# Altium schematic sheet схема платы фотодетектора.SchDoc
size A3
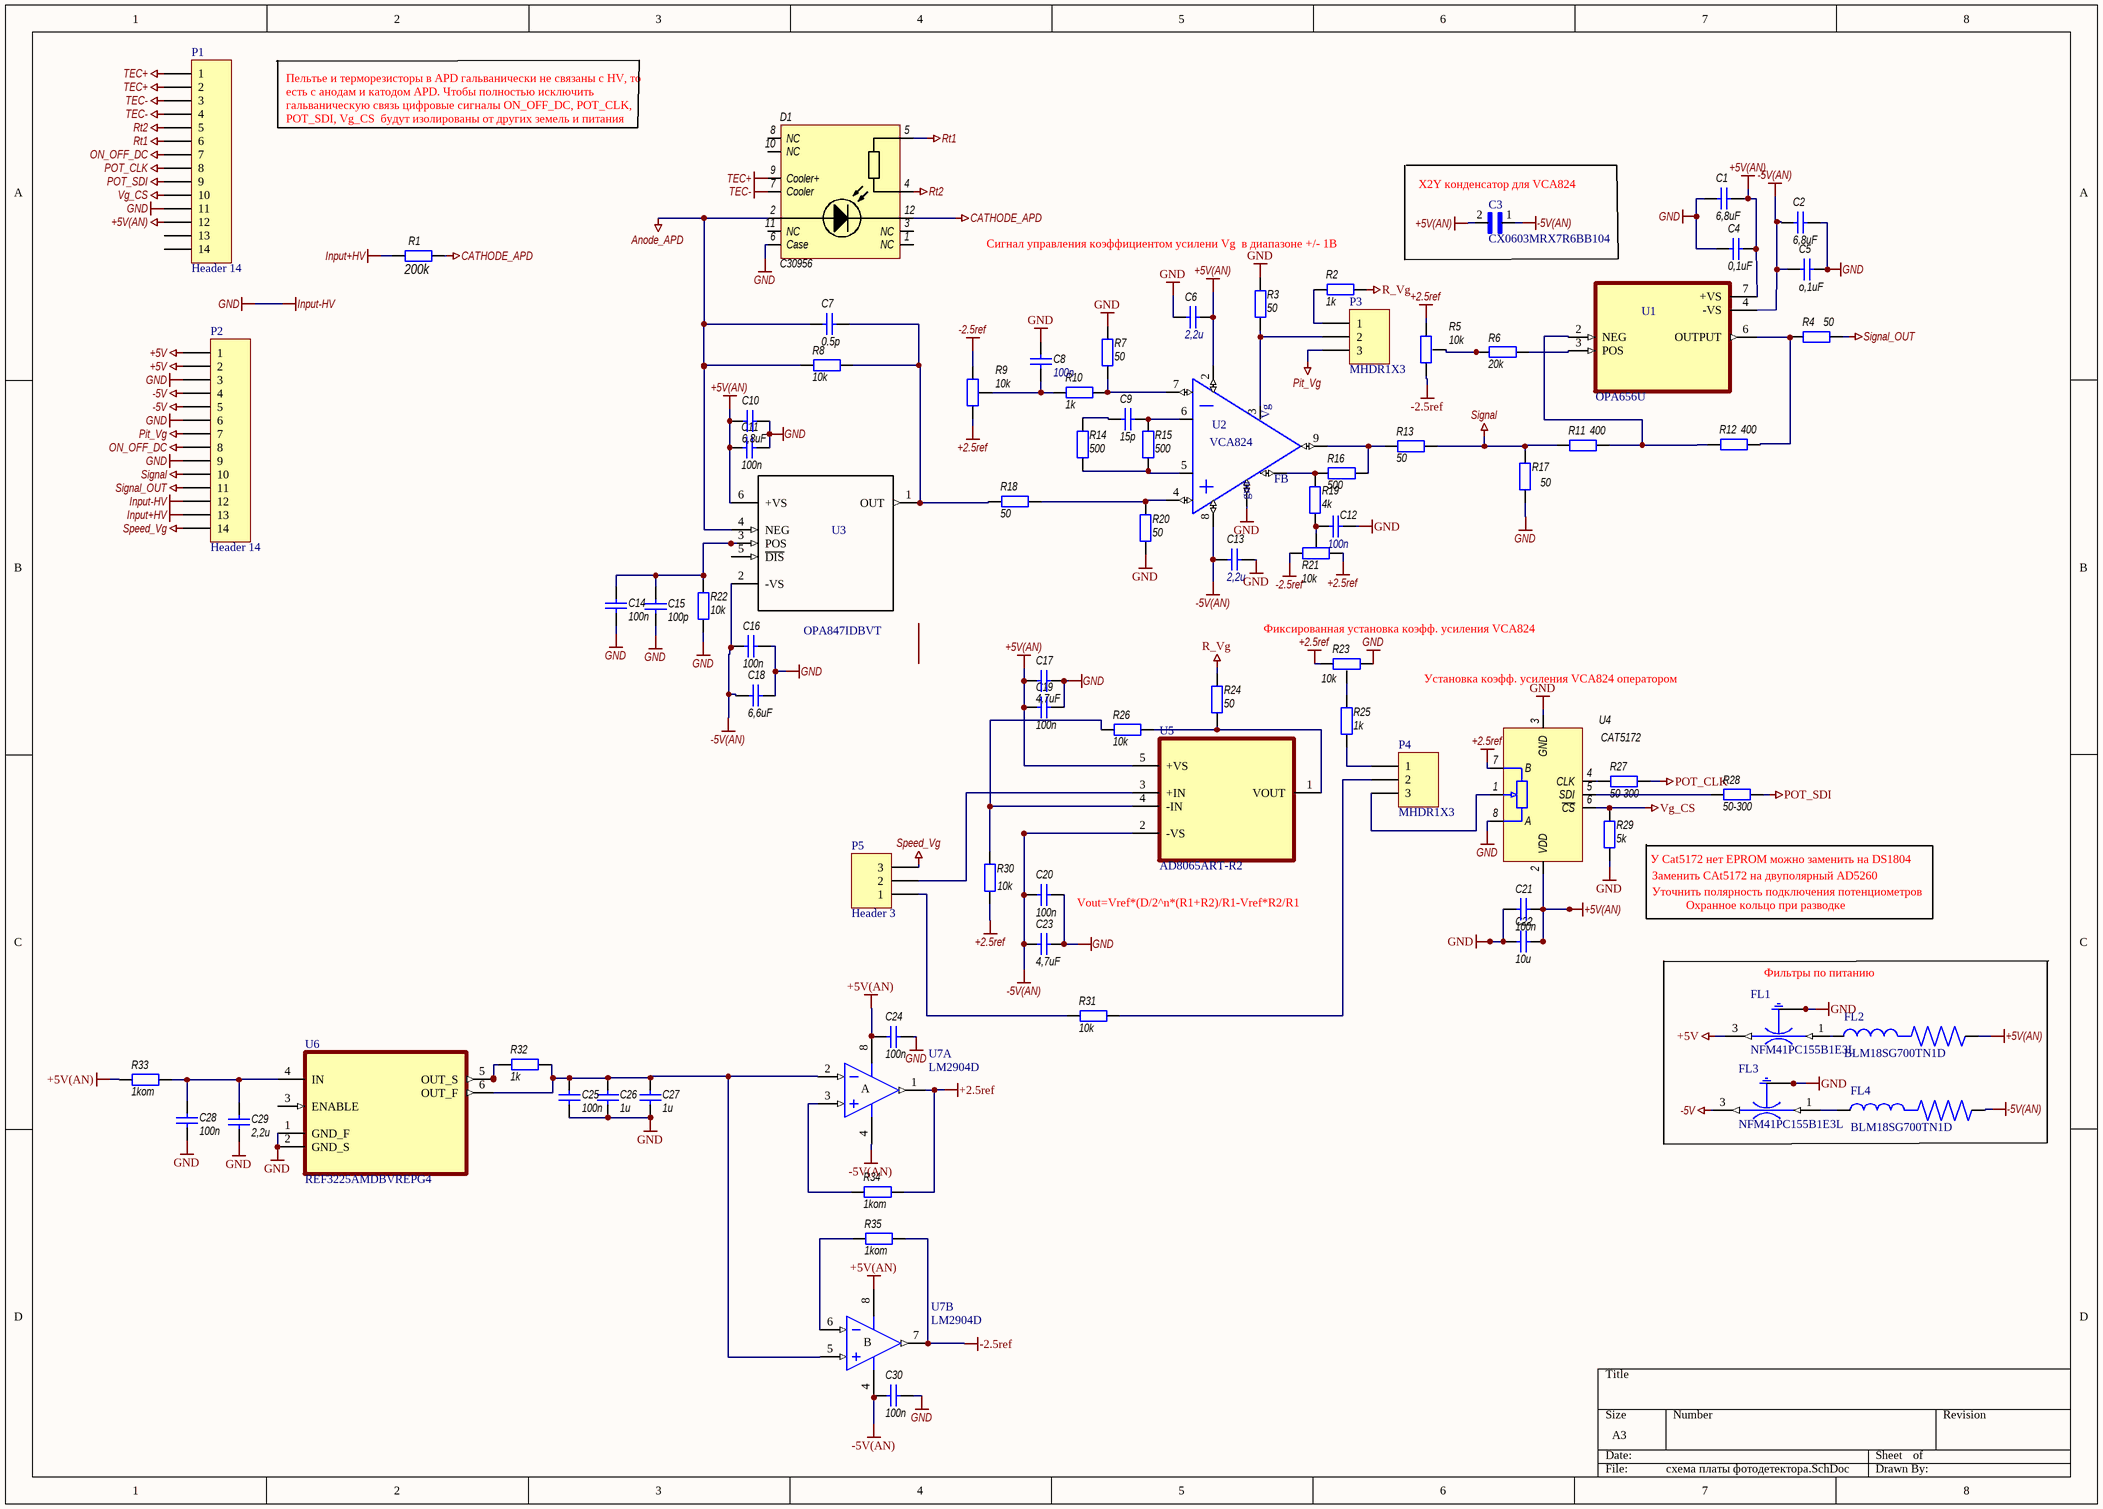
[diagram p0: схема платы фотодетектора.SchDoc]

## Parts
C1  6,8uF  [0603]
C2  6,8uF  [0603]
C3  CX0603MRX7R6BB104  [CAPC1608X90]
C4  0,1uF  [0603]
C5  o,1uF  [0603]
C6  2,2u  [0603]
C7  0.5p  [0603]
C8  100n  [0603]
C9  15p  [0603]
C10  6,8uF  [0603]
C11  100n  [0603]
C12  100n  [0603]
C13  2,2u  [0603]
C14  100n  [0603]
C15  100p  [0603]
C16  100n  [0603]
C17  4,7uF  [0603]
C18  6,6uF  [0603]
C19  100n  [0603]
C20  100n  [0603]
C21  100n  [0603]
C22  10u  [0603]
C23  4,7uF  [0603]
C24  100n  [0603]
C25  100n  [0603]
C26  1u  [0603]
C27  1u  [0603]
C28  100n  [0603]
C29  2,2u  [0603]
C30  100n  [0603]
D1  C30956  [C30659]
FL1  NFM41PC155B1E3L  [FIL_NFM41PC155B1E3L]
FL2  BLM18SG700TN1D  [BEADC2012X105N]
FL3  NFM41PC155B1E3L  [FIL_NFM41PC155B1E3L]
FL4  BLM18SG700TN1D  [BEADC2012X105N]
P1  Header 14  [HDR1X14]
P2  Header 14  [HDR1X14]
P3  MHDR1X3  [HDR1X3]
P4  MHDR1X3  [HDR1X3]
P5  Header 3  [HDR1X3]
R1  value 200k  [0603]  (hidden comment: CHV1206)
R2  1k  [0603]
R3  50  [0603]
R4  50  [0603]
R5  10k  [respotBourns]
R6  20k  [0603]
R7  50  [0603]
R8  10k  [0603]
R9  10k  [respotBourns]
R10  1k  [0603]
R11  400  [0603]
R12  400  [0603]
R13  50  [0603]
R14  500  [0603]
R15  500  [0603]
R16  500  [0603]
R17  50  [0603]
R18  50  [0603]
R19  4k  [0603]
R20  50  [0603]
R21  10k  [respotBourns]
R22  10k  [0603]
R23  10k  [respotBourns]
R24  50  [0603]
R25  1k  [0603]
R26  10k  [0603]
R27  50-300  [0603]
R28  50-300  [0603]
R29  5k  [0603]
R30  10k  [0603]
R31  10k  [0603]
R32  1k  [0603]
R33  1kom  [0603]
R34  1kom  [0603]
R35  1kom  [0603]
U1  OPA656U  [SOIC127P599X175-8N]
U2  VCA824  [MSOP10]
U3  OPA847IDBVT  [*SOT95P280X145-6N]
U4  CAT5172  [SOT238]
U5  AD8065ART-R2  [SOT95P290X145-5N]
U6  REF3225AMDBVREPG4  [SOT95P280X145-6N]
U7  LM2904D  [SO8_L]  (parts A,B of 2)

## Blocks framed on the sheet
X2Y конденсатор для VCA824: C3

## Nets
+2.5ref: R5.1 R9.3 R21.3 R23.3 R30.1 R34.1 U4.7(B) U7.1(OUT)
+5V: FL1.3(OUT) P2.1 P2.2
+5V(AN): C1.1 C3.2 C4.1 C6.1 C10.1 C11.2 C17.2 C19.2 C21.2 C22.2 C24.2 FL2.2 P1.12 R33.2 U1.7(+VS) U2.2(V+) U3.6(+VS) U4.2(VDD) U5.5(+VS) U7.8(V+)
-2.5ref: R5.3 R9.1 R21.1 R35.1 U7.7(OUT)
-5V: FL3.3(OUT) P2.4 P2.5
-5V(AN): C2.2 C3.1 C5.2 C13.2 C16.2 C18.1 C20.2 C23.2 C30.2 FL4.2 U1.4(-VS) U2.8(V-) U3.2(-VS) U5.2(-VS) U7.4(V-)
Anode_APD: C7.2 D1.2 R8.1 U3.4(NEG)
CATHODE_APD: D1.12 R1.2
GND: C1.2 C2.1 C4.2 C5.1 C6.2 C8.2 C10.2 C11.1 C12.1 C13.1 C14.1 C15.2 C16.1 C17.1 C18.2 C19.1 C20.1 C21.1 C22.1 C23.1 C24.1 C25.1 C26.1 C27.1 C28.1 C29.1 C30.1 D1.6(Case) FL1.2(GND) FL1.2_1(GND) FL1.2_3(GND) FL1.2_4(GND) FL3.2(GND) FL3.2_1(GND) FL3.2_3(GND) FL3.2_4(GND) P1.11 P2.3 P2.6 P2.9 P2.12 R3.2 R7.2 R17.1 R20.1 R22.2 R23.1 R29.1 U2.10(GND) U4.3(GND) U4.8(A) U6.1(GND_F) U6.2(GND_S)  [also labelled Input-HV]
Input+HV: P2.13 R1.1
ON_OFF_DC: P1.7 P2.8
Pit_Vg: P2.7 P3.3
POT_CLK: P1.8 R27.2
POT_SDI: P1.9 R28.2
R_Vg: R2.2 R24.2
Rt1: D1.5 P1.6
Rt2: D1.4 P1.5
Signal: P2.10 R11.1 R13.2 R17.2
Signal_OUT: P2.11 R4.2
Speed_Vg: P2.14 P5.3
TEC+: D1.9(Cooler+) P1.1 P1.2
TEC-: D1.7(Cooler) P1.3 P1.4
Vg_CS: P1.10 R29.2 U4.6(~{CS})
NetC7_1: C7.1 R8.2 R18.1 U3.1(OUT)
NetC8_1: C8.1 R9.2 R10.1
NetC9_1: C9.1 R15.2 U2.6(RG-)
NetC9_2: C9.2 R14.2
NetC12_2: C12.2 R19.1 R21.2
NetC14_2: C14.2 C15.1 R22.1 U3.3(POS)
NetC25_2: C25.2 C26.2 C27.2 R32.2 U6.6(OUT_F) U7.2(IN-) U7.5(IN+)
NetC28_2: C28.2 C29.2 R33.1 U6.4(IN)
NetFL1_1: FL1.1(IN) FL2.1
NetFL3_1: FL3.1(IN) FL4.1
NetP3_1: P3.1 R2.1
NetP3_2: P3.2 R3.1 U2.3(VG)
NetP4_1: P4.1 R25.1
NetP4_2: P4.2 R31.2
NetP4_3: P4.3 U4.1
NetP5_1: P5.1 R31.1
NetP5_2: P5.2 U5.3(+IN)
NetR4_1: R4.1 R12.2 U1.6(OUTPUT)
NetR5_2: R5.2 R6.1
NetR6_2: R6.2 U1.3(POS)
NetR7_1: R7.1 R10.2 U2.7(IN-)
NetR11_2: R11.2 R12.1 U1.2(NEG)
NetR13_1: R13.1 R16.2 U2.9(OUT)
NetR14_1: R14.1 R15.1 U2.5(RG+)
NetR16_1: R16.1 R19.2 U2.1(FB)
NetR18_2: R18.2 R20.2 U2.4(IN+)
NetR23_2: R23.2 R25.2
NetR24_1: R24.1 R26.2 U5.1(VOUT)
NetR26_1: R26.1 R30.2 U5.4(-IN)
NetR27_1: R27.1 U4.4(CLK)
NetR28_1: R28.1 U4.5(SDI)
NetR32_1: R32.1 U6.5(OUT_S)
NetR34_2: R34.2 U7.3(IN+)
NetR35_2: R35.2 U7.6(IN-)

Not connected (* = marked no-connect by the designer): D1 1(NC) 3(NC) 8(NC) 10(NC) 11(NC); P1 13 14; U3 5(~{DIS}); U6 3(ENABLE)

## Notes on the sheet
- Пельтье и терморезисторы в APD гальванически не связаны с HV, то есть с анодам и катодом APD. Чтобы полностью исключить гальваническую связь цифровые сигналы ON_OFF_DC, POT_CLK, POT_SDI, Vg_CS  будут изолированы от других земель и питания
- Сигнал управления коэффициентом усилени Vg  в диапазоне +/- 1В
- (near R23) Фиксированная установка коэфф. усиления VCA824
- Установка коэфф. усиления VCA824 оператором
- Vout=Vref*(D/2^n*(R1+R2)/R1-Vref*R2/R1
- У Cat5172 нет EPROM можно заменить на DS1804
- Уточнить полярность подключения потенциометров
- Заменить CAt5172 на двуполярный AD5260
- Охранное кольцо при разводке
- (near FL1) Фильтры по питанию
- (in symbol LM2904D, part A) A
- (in symbol LM2904D, part B) B
- (in symbol VCA824) Vg; gnd

## Library data of the parts
C1 C2 C4-C6 C9 C10 C13 C17 C18 C22 C23 C26 C27 C29 = _capacitor: Model: 0603 100n; Value: 100n
C3 = CX0603MRX7R6BB104: 0.1ÂµF Â±20% 10V Ceramic Capacitor X7R 0603 (1608 Metric); MF: Yageo; Package: 0603 Yageo; Value: *; Price: None; MP: CX0603MRX7R6BB104; SnapEDA_Link: https://www.snapeda.com/parts/CX0603MRX7R6BB104/Yageo/view-part/493624/?ref=snap; Availability: Unavailable
C7 = _capacitor: Model: 0603 0.5p; Value: 0.5p
C8 C11 C12 C14 C16 C19-C21 C24 C25 C28 C30 = _capacitor: Model: 0603 100n; Value: 100n
C15 = _capacitor: Model: 0603 100p; Value: 100p
D1 = C30956: ADP_Diod; Model: C30956
FL1 FL3 = NFM41PC155B1E3L: ÐšÐ¾Ð½Ð´ÐµÐ½ÑÐ°Ñ‚Ð¾Ñ€ SMD Ñ ÐµÐ¼ÐºÐ¾ÑÑ‚ÑŒÑŽ: 1.5 ÐœÐšÐ¤ Ð¢Ð¾Ð». 20%. ÐÐ¾Ð¼Ð¸Ð½Ð°Ð»ÑŒÐ½Ð¾Ðµ Ð½Ð°Ð¿Ñ€ÑÐ¶ÐµÐ½Ð¸Ðµ: 25Vdc; MF: Murata; Price: None; Value: *; SnapEDA_Link: https://www.snapeda.com/parts/NFM41PC155B1E3L/Murata/view-part/4383493/?ref=snap; Package: NONSTANDARD; Availability: Unavailable; DigiKey-Purchase-URL: https://snapeda.com/shop?store=DigiKey&id=4383493; MP: NFM41PC155B1E3L
FL2 FL4 = BLM21SP111SN1D: 110 Ð¾Ð¼ @ 100 ÐœÐ“Ñ† 1 Ð»Ð¸Ð½Ð¸Ñ ÑÐ»ÐµÐºÑ‚Ñ€Ð¾Ð¿ÐµÑ€ÐµÐ´Ð°Ñ‡ Ñ„ÐµÑ€Ñ€Ð¸Ñ‚Ð¾Ð²Ñ‹Ð¹ ÑˆÐ°Ñ€Ð¸Ðº 0805 (2012 ÐœÐµÑ‚Ñ€Ð¸ÐºÐ°) 5A; MF: Murata; Price: None; Value: *; SnapEDA_Link: https://www.snapeda.com/parts/BLM21SP111SN1D/Murata/view-part/4302973/?ref=snap; Package: 2012 Murata; Availability: Unavailable; MP: BLM21SP111SN1D
P1 P2 = Header 14: Header, 14-Pin; LatestRevisionDate: 17-Jul-2002; LatestRevisionNote: Re-released for DXP Platform.; Publisher: Altium Limited
P3 P4 = MHDR1X3: Header, 3-Pin; LatestRevisionDate: 17-Jul-2002; LatestRevisionNote: Re-released for DXP Platform.; Publisher: Altium Limited
P5 = Header 3: Header, 3-Pin; LatestRevisionDate: 17-Jul-2002; LatestRevisionNote: Re-released for DXP Platform.; Publisher: Altium Limited
R1 = _resistor: Model: 1206 10mOm
R2 R3 R7 R10 R13-R16 R18-R20 R24-R32 = _resistor: Model: 0603 51; Value: 51
R4 R11 R12 = _resistor: Model: 0603 10; Value: 10
R5 R9 R21 = _resistor_pot: 3224J-1-103; Model: 3266P-1-102LF; Value: 1k
R6 = _resistor: Model: 0603 10k; Value: 10k
R8 R22 = _resistor: Model: 0603 10k; Value: 10k
R17 R33-R35 = _resistor: Model: 0603 100; Value: 100
R23 = _resistor_pot: 3224j-1-103; Model: 3266P-1-102LF; Value: 1k
U1 = OPA656U: Wideband, Unity Gain Stable FET-Input Operational Amplifier; MF: Texas Instruments; Package: SOIC-8 Texas Instruments; Value: *; Price: None; Availability: Unavailable; MP: OPA656U; Texas_Instruments-Purchase-URL: https://snapeda.com/shop?store=Texas+Instruments&id=454826; Mouser-Purchase-URL: https://snapeda.com/shop?store=Mouser&id=454826; DigiKey-Purchase-URL: https://snapeda.com/shop?store=DigiKey&id=454826; SnapEDA_Link: https://www.snapeda.com/parts/OPA656U/Texas%20Instruments/view-part/454826/?ref=snap
U2 = VCA824: MF: Texas Instruments; Price: None; Value: *; SnapEDA_Link: https://www.snapeda.com/parts/VCA824/Texas%20Instruments/view-part/570912/?ref=snap; Package: None; Availability: Unavailable; MP: VCA824
U4 = CAT5172: Digital potentiometr 256-position SPI; Model: CAT5172; ComponentLink1Description: Datasheet; ComponentLink1URL: X:\Projects\__MY_AD_LIB\Datasheets\CAT5172.pdf
U5 = AD8065ART-R2: Ð£ÑÐ¸Ð»Ð¸Ñ‚ÐµÐ»ÑŒ Ð¾Ð±Ñ€Ð°Ñ‚Ð½Ð¾Ð¹ ÑÐ²ÑÐ·Ð¸ Ð¿Ð¾ Ð½Ð°Ð¿Ñ€ÑÐ¶ÐµÐ½Ð¸ÑŽ 1 Ñ†ÐµÐ¿ÑŒ Ñ€ÐµÐ»ÑŒÑ-Ñ€ÐµÐ»ÑŒÑ SOT-23-5; MF: Analog Devices; MP: AD8065ART-R2; Package: SOT-23-5 Analog Devices; SnapEDA_Link: https://www.snapeda.com/parts/AD8065ART-R2/Analog%20Devices%20Inc./view-part/888431/?ref=snap; Price: None; Availability: Unavailable; Value: *; DigiKey-Purchase-URL: https://snapeda.com/shop?store=DigiKey&id=888431
U6 = REF3225AMDBVREPG4: Ð£Ð²ÐµÐ»Ð¸Ñ‡ÐµÐ½Ð½Ñ‹Ð¹ Ð¿Ñ€Ð¾Ð´ÑƒÐºÑ‚ 4 Ppm/Degreesc 100 UA Sot23-6 ÑÐµÑ€Ð¸Ñ ÑÐ¿Ñ€Ð°Ð²ÐºÐ¸ Ð½Ð°Ð¿Ñ€ÑÐ¶ÐµÐ½Ð¸Ñ Ñ‚Ð¾ÐºÐ° 6-SOT-23 -55 Ð´Ð¾ 125; MF: Texas Instruments; Package: SOT-23 Texas Instruments; Value: *; Availability: Unavailable; SnapEDA_Link: https://www.snapeda.com/parts/REF3225AMDBVREPG4/Texas%20Instruments/view-part/575270/?ref=snap; Price: None; MP: REF3225AMDBVREPG4
U7 = LM2904D: Low-Power Dual Operational Amplifier; Published: 24-Aug-2001; LatestRevisionDate: 13-Apr-2006; LatestRevisionNote: IPC-7351 Footprint Added.; DatasheetVersion: Jan-1999; PackageVersion: Dec-2002; PackageReference: SO8; Publisher: Altium Limited; PackageDescription: 8-Pin Small Outline Integrated Circuit 1.27 mm Pitch; Code_JEDEC: MS-012-AA; Code_IPC: SOIC127P600-8; ComponentLink1Description: Manufacturer Link; ComponentLink1URL: http://www.st.com/; ComponentLink2Description: Datasheet; ComponentLink2URL: http://www.st.com/stonline/products/literature/ds/2471/lm2904.pdf
U3 = OPA847IDBVT: Value: *